# Altium schematic sheet mpc57_cpuio2.SchDoc: CPU I/O Bank 2
size Letter; Organization: NewAE Technology Inc.; Address1: 1083 Queen St., Suite 196; Address2: Halifax; Address3: NS; Address4: Canada B3H 0B2; SheetApproved: YES
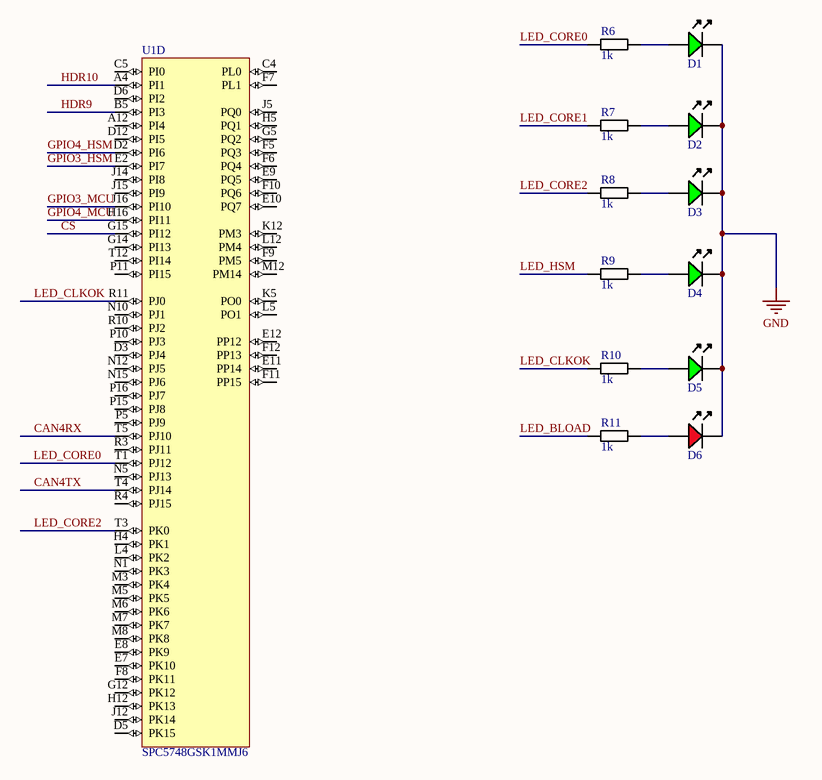
[diagram p0: mpc57_cpuio2.SchDoc]

## Parts
D1  LED, 0603, Green  [LED-0603-GREEN]  (value not drawn)
D2  LED, 0603, Green  [LED-0603-GREEN]  (value not drawn)
D3  LED, 0603, Green  [LED-0603-GREEN]  (value not drawn)
D4  LED, 0603, Green  [LED-0603-GREEN]  (value not drawn)
D5  LED, 0603, Green  [LED-0603-GREEN]  (value not drawn)
D6  LED, 0603, Red  [LED-0603-RED]  (value not drawn)
R6  1k  [RESC1608X55N]
R7  1k  [RESC1608X55N]
R8  1k  [RESC1608X55N]
R9  1k  [RESC1608X55N]
R10  1k  [RESC1608X55N]
R11  1k  [RESC1608X55N]
U1  SPC5748GSK1MMJ6  [BGA256C100P16X16_1700X1700X170]  (part D of 5)

## Nets
GND: D1.K D2.K D3.K D4.K D5.K D6.K
CAN4RX: U1.T5(PJ10)
CAN4TX: U1.T4(PJ14)
CS: U1.G15(PI12)
GPIO3_HSM: U1.E2(PI7)
GPIO3_MCU: U1.J16(PI10)
GPIO4_HSM: U1.D2(PI6)
GPIO4_MCU: U1.H16(PI11)
HDR9: U1.B5(PI3)
HDR10: U1.A4(PI1)
LED_BLOAD: R11.1
LED_CLKOK: R10.1 U1.R11(PJ0)
LED_CORE0: R6.1 U1.T1(PJ12)
LED_CORE1: R7.1
LED_CORE2: R8.1 U1.T3(PK0)
LED_HSM: R9.1
NetD1_A: D1.A R6.2
NetD2_A: D2.A R7.2
NetD3_A: D3.A R8.2
NetD4_A: D4.A R9.2
NetD5_A: D5.A R10.2
NetD6_A: D6.A R11.2

Not connected (* = marked no-connect by the designer): U1 A12(PI4) C4(PL0) C5(PI0) D3(PJ4) D5(PK15) D6(PI2) D12(PI5) E7(PK10) E8(PK9) E9(PQ5) E10(PQ7) E11(PP14) E12(PP12) F5(PQ3) F6(PQ4) F7(PL1) F8(PK11) F9(PM5) F10(PQ6) F11(PP15) F12(PP13) G5(PQ2) G12(PK12) G14(PI13) H4(PK1) H5(PQ1) H12(PK13) J5(PQ0) J12(PK14) J14(PI8) J15(PI9) K5(PO0) K12(PM3) L4(PK2) L5(PO1) L12(PM4) M3(PK4) M5(PK5) M6(PK6) M7(PK7) M8(PK8) M12(PM14) N1(PK3) N5(PJ13) N10(PJ1) N12(PJ5) N15(PJ6) P5(PJ9) P10(PJ3) P11(PI15) P15(PJ8) P16(PJ7) R3(PJ11) R4(PJ15) R10(PJ2) T12(PI14)

## Notes on the sheet
- Title:
- Date:
- Rev:
- Time:
- Project:
- Sheet
- of
- License:
- Copyright © NewAE Technology Inc.
- Approved:
- NewAE.com
- File:

## Library data of the parts
D1-D5 = LEDCHIP_0603_GREEN: Chip LED, Green; Part Number: LEDCHIP_0603_GREEN; Component Kind: Standard; Component Type: Standard; Pin Count: 2; Mounting Technology: SMT
D6 = LEDCHIP_0603_RED: Chip LED, Red; Part Number: LEDCHIP_0603_RED; Component Kind: Standard; Component Type: Standard; Pin Count: 2; Mounting Technology: SMT
R6-R11 = RCHIP-1K-0603: 1k res, 0603, 1%, 1/10W; Manufacture 1: Yageo; Manufacture Part Number 1: RC0603FR-071KL; Case-EIA: 0603; Case-Metric: 1608; Rated Power: 0.1W; Rated Voltage: 75VDC; Part Number: RCHIP-1K-0603; Component Kind: Standard; Component Type: Standard; Footprint: 0603; Pin Count: 2; Supplier 1: Digi-Key; Supplier Part Number 1: 311-1.00KHRCT-ND; Value: 1k; Tolerance: 1%; Mounting Technology: SMT; Temperature Range: -55C to 155C
U1 = SPC5748GSK1MMJ6: Freescale 32-bit MCU, Triple core, 6MB Flash, 160MHz, -40/+125degC, Automotive Qualified, BGA 256